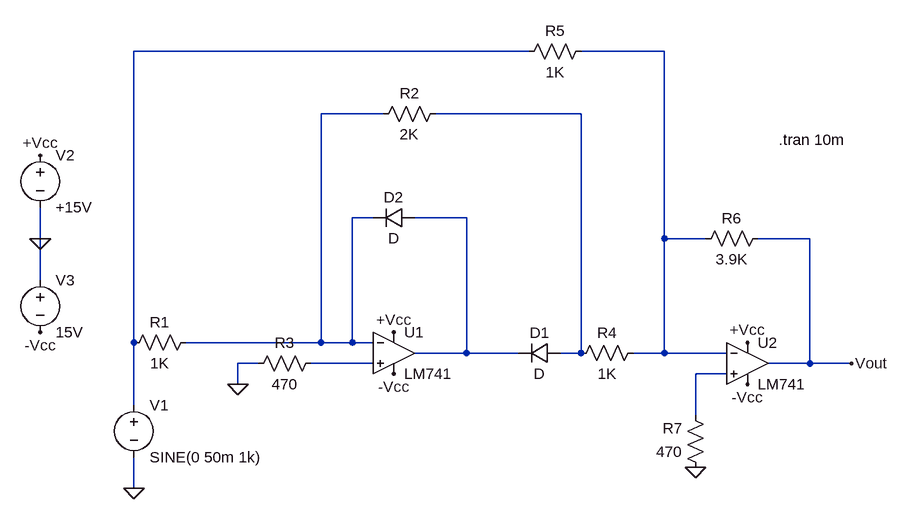
[diagram p0: schematic Full Wave Rectifier.asc]
Full Wave Rectifier.asc, the LTspice schematic file:
Version 4
SHEET 1 1012 680
WIRE 384 -304 -224 -304
WIRE 592 -304 464 -304
WIRE 160 -208 64 -208
WIRE 464 -208 240 -208
WIRE 144 -48 112 -48
WIRE 288 -48 208 -48
WIRE -368 -16 -368 -64
WIRE 592 -16 592 -304
WIRE 656 -16 592 -16
WIRE 816 -16 736 -16
WIRE -368 48 -368 -16
WIRE -224 144 -224 -304
WIRE 64 144 64 -208
WIRE 64 144 -144 144
WIRE 112 144 112 -48
WIRE 112 144 64 144
WIRE 144 144 112 144
WIRE 288 160 288 -48
WIRE 288 160 208 160
WIRE 368 160 288 160
WIRE 464 160 464 -208
WIRE 464 160 432 160
WIRE 592 160 592 -16
WIRE 592 160 544 160
WIRE 688 160 592 160
WIRE -32 176 -64 176
WIRE 144 176 48 176
WIRE 816 176 816 -16
WIRE 816 176 752 176
WIRE 880 176 816 176
WIRE 688 192 640 192
WIRE -64 208 -64 176
WIRE -224 240 -224 144
WIRE 640 256 640 192
WIRE -224 368 -224 320
FLAG -224 368 0
FLAG -64 208 0
FLAG -368 -16 0
FLAG 176 128 +Vcc
FLAG -368 -144 +Vcc
FLAG 176 192 -Vcc
FLAG -368 128 -Vcc
FLAG 640 336 0
FLAG 720 144 +Vcc
FLAG 720 208 -Vcc
FLAG 880 176 Vout
SYMBOL Opamps\\LM741 176 96 R0
SYMATTR InstName U1
SYMBOL res -128 128 R90
WINDOW 0 0 56 VBottom 2
WINDOW 3 32 56 VTop 2
SYMATTR InstName R1
SYMATTR Value 1K
SYMBOL res 256 -224 R90
WINDOW 0 0 56 VBottom 2
WINDOW 3 32 56 VTop 2
SYMATTR InstName R2
SYMATTR Value 2K
SYMBOL res 64 160 R90
WINDOW 0 0 56 VBottom 2
WINDOW 3 32 56 VTop 2
SYMATTR InstName R3
SYMATTR Value 470
SYMBOL voltage -224 224 R0
SYMATTR InstName V1
SYMATTR Value SINE(0 50m 1k)
SYMBOL voltage -368 -160 R0
SYMATTR InstName V2
SYMATTR Value +15V
SYMBOL voltage -368 32 R0
SYMATTR InstName V3
SYMATTR Value 15V
SYMBOL diode 432 144 R90
WINDOW 0 0 32 VBottom 2
WINDOW 3 32 32 VTop 2
SYMATTR InstName D1
SYMBOL diode 208 -64 R90
WINDOW 0 0 32 VBottom 2
WINDOW 3 32 32 VTop 2
SYMATTR InstName D2
SYMBOL res 560 144 R90
WINDOW 0 0 56 VBottom 2
WINDOW 3 32 56 VTop 2
SYMATTR InstName R4
SYMATTR Value 1K
SYMBOL res 480 -320 R90
WINDOW 0 0 56 VBottom 2
WINDOW 3 32 56 VTop 2
SYMATTR InstName R5
SYMATTR Value 1K
SYMBOL res 752 -32 R90
WINDOW 0 0 56 VBottom 2
WINDOW 3 32 56 VTop 2
SYMATTR InstName R6
SYMATTR Value 3.9K
SYMBOL res 656 352 R180
WINDOW 0 36 76 Left 2
WINDOW 3 36 40 Left 2
SYMATTR InstName R7
SYMATTR Value 470
SYMBOL Opamps\\LM741 720 112 R0
SYMATTR InstName U2
TEXT 768 -168 Left 2 !.tran 10m

The netlist it stands for:
* Full Wave Rectifier.asc
XU1 N006 N003 +Vcc -Vcc N005 LM741  ; pins In+ In- V+ V- OUT
R1 N003 N001 1K
R2 N004 N003 2K
R3 N006 0 470
V1 N001 0 SINE(0 50m 1k)
V2 +Vcc 0 +15V
V3 0 -Vcc 15V
D1 N004 N005 D
D2 N005 N003 D
R4 N002 N004 1K
R5 N002 N001 1K
R6 Vout N002 3.9K
R7 0 N007 470
XU2 N007 N002 +Vcc -Vcc Vout LM741  ; pins In+ In- V+ V- OUT
.model D D
.lib standard.dio
.tran 10m
.lib LM741.lib
.backanno
.end